# Altium schematic sheet leds.SchDoc
size A4
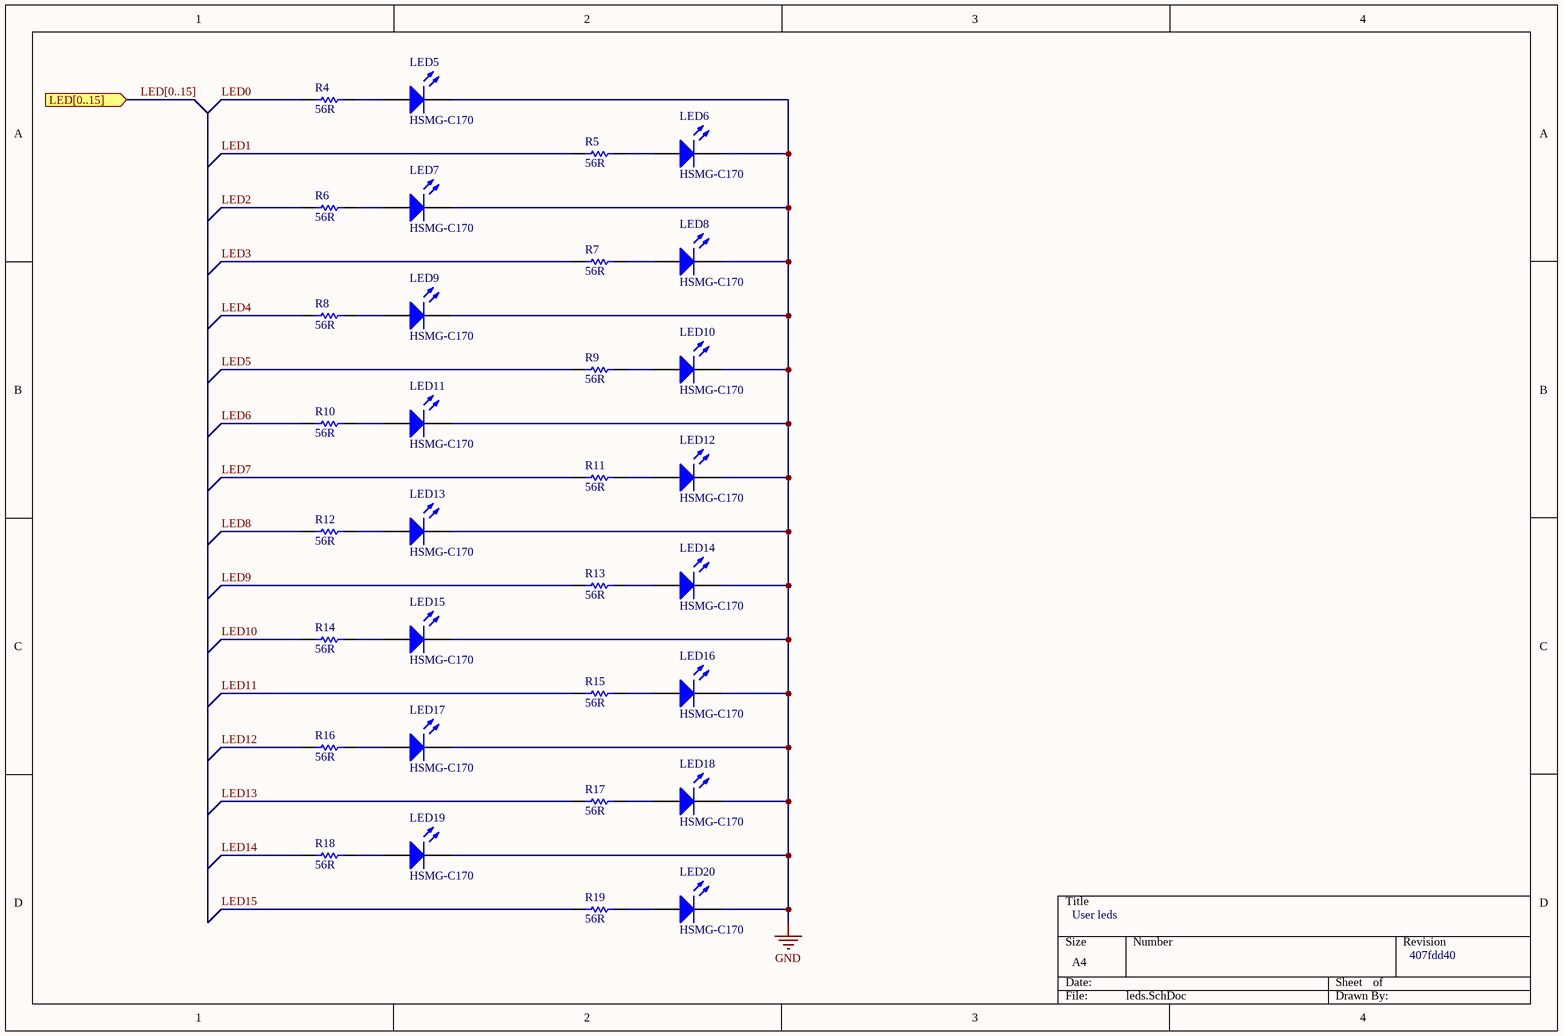
[diagram p0: leds.SchDoc]

## Parts
LED5  HSMG-C170  [2.0X1.25X0.8]
LED6  HSMG-C170  [2.0X1.25X0.8]
LED7  HSMG-C170  [2.0X1.25X0.8]
LED8  HSMG-C170  [2.0X1.25X0.8]
LED9  HSMG-C170  [2.0X1.25X0.8]
LED10  HSMG-C170  [2.0X1.25X0.8]
LED11  HSMG-C170  [2.0X1.25X0.8]
LED12  HSMG-C170  [2.0X1.25X0.8]
LED13  HSMG-C170  [2.0X1.25X0.8]
LED14  HSMG-C170  [2.0X1.25X0.8]
LED15  HSMG-C170  [2.0X1.25X0.8]
LED16  HSMG-C170  [2.0X1.25X0.8]
LED17  HSMG-C170  [2.0X1.25X0.8]
LED18  HSMG-C170  [2.0X1.25X0.8]
LED19  HSMG-C170  [2.0X1.25X0.8]
LED20  HSMG-C170  [2.0X1.25X0.8]
R4  value 56R  [RESC1206(3216)_N]  (hidden comment: 56R 5% 1206(3216))
R5  value 56R  [RESC1206(3216)_N]  (hidden comment: 56R 5% 1206(3216))
R6  value 56R  [RESC1206(3216)_N]  (hidden comment: 56R 5% 1206(3216))
R7  value 56R  [RESC1206(3216)_N]  (hidden comment: 56R 5% 1206(3216))
R8  value 56R  [RESC1206(3216)_N]  (hidden comment: 56R 5% 1206(3216))
R9  value 56R  [RESC1206(3216)_N]  (hidden comment: 56R 5% 1206(3216))
R10  value 56R  [RESC1206(3216)_N]  (hidden comment: 56R 5% 1206(3216))
R11  value 56R  [RESC1206(3216)_N]  (hidden comment: 56R 5% 1206(3216))
R12  value 56R  [RESC1206(3216)_N]  (hidden comment: 56R 5% 1206(3216))
R13  value 56R  [RESC1206(3216)_N]  (hidden comment: 56R 5% 1206(3216))
R14  value 56R  [RESC1206(3216)_N]  (hidden comment: 56R 5% 1206(3216))
R15  value 56R  [RESC1206(3216)_N]  (hidden comment: 56R 5% 1206(3216))
R16  value 56R  [RESC1206(3216)_N]  (hidden comment: 56R 5% 1206(3216))
R17  value 56R  [RESC1206(3216)_N]  (hidden comment: 56R 5% 1206(3216))
R18  value 56R  [RESC1206(3216)_N]  (hidden comment: 56R 5% 1206(3216))
R19  value 56R  [RESC1206(3216)_N]  (hidden comment: 56R 5% 1206(3216))

## Ports
LED[0..15] (in)

## Nets
GND: LED5.2(K) LED6.2(K) LED7.2(K) LED8.2(K) LED9.2(K) LED10.2(K) LED11.2(K) LED12.2(K) LED13.2(K) LED14.2(K) LED15.2(K) LED16.2(K) LED17.2(K) LED18.2(K) LED19.2(K) LED20.2(K)
LED0: R4.1
LED1: R5.1
LED2: R6.1
LED3: R7.1
LED4: R8.1
LED5: R9.1
LED6: R10.1
LED7: R11.1
LED8: R12.1
LED9: R13.1
LED10: R14.1
LED11: R15.1
LED12: R16.1
LED13: R17.1
LED14: R18.1
LED15: R19.1
NetLED5_1: LED5.1(A) R4.2
NetLED6_1: LED6.1(A) R5.2
NetLED7_1: LED7.1(A) R6.2
NetLED8_1: LED8.1(A) R7.2
NetLED9_1: LED9.1(A) R8.2
NetLED10_1: LED10.1(A) R9.2
NetLED11_1: LED11.1(A) R10.2
NetLED12_1: LED12.1(A) R11.2
NetLED13_1: LED13.1(A) R12.2
NetLED14_1: LED14.1(A) R13.2
NetLED15_1: LED15.1(A) R14.2
NetLED16_1: LED16.1(A) R15.2
NetLED17_1: LED17.1(A) R16.2
NetLED18_1: LED18.1(A) R17.2
NetLED19_1: LED19.1(A) R18.2
NetLED20_1: LED20.1(A) R19.2

## Buses and harness runs
bus LED[0..15] = port LED[0..15]

## Notes on the sheet
- User leds
- 407fdd40

## Library data of the parts
LED5-LED20 = HSMG-C170: Surface Mount Chip LED, Green; LuminousIntensity: 4mcd (Minimum).; PCB_Layout: Complies with manufacturer's recommendation.; Published: 11-Dec-2002; DatasheetVersion: 30-Apr-2002; PackageVersion: Oct-2001; PackageReference: 2.0X1.25X0.8; Publisher: Altium Limited; PackageDescription: SM LED; 2 Flat Leads; LED_Colour: Green; ComponentLink1Description: Manufacturer Link; ComponentLink1URL: http://www.avagotech.com/; ComponentLink2Description: Datasheet; ComponentLink2URL: http://cp.literature.agilent.com/litweb/pdf/5988-6271EN.pdf
R4-R19 = CMP-1014-00044-1: 56R 0.25W 5% 1206 (3216 Metric)  SMD; Case-EIA: 1206; Case-Metric: 3216; Technology: SMT; Tolerance: 5 %; Power: 0.25 W